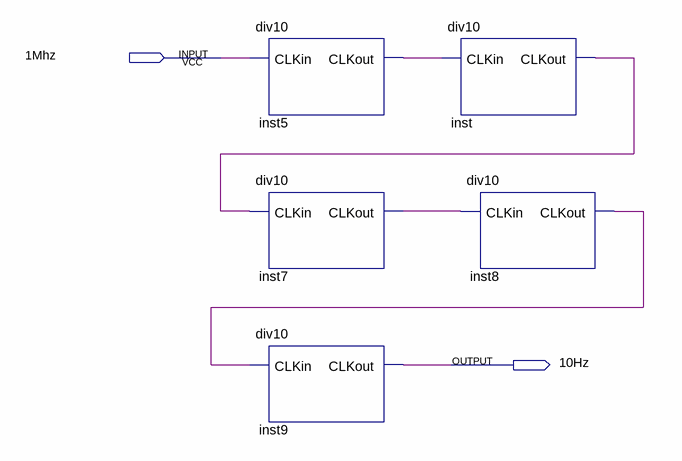
[diagram p0: schematic sheet]
// Quartus schematic gerador10Hz.bdf as structural Verilog: 5 symbols, 2 pins
module gerador10Hz (
  input  \1Mhz ,
  output \10Hz 
);

  wire inst5_clkout, inst7_clkout, inst8_clkout, inst_clkout;

  div10 inst5 (.CLKin(\1Mhz ), .CLKout(inst5_clkout));
  div10 inst7 (.CLKin(inst_clkout), .CLKout(inst7_clkout));
  div10 inst9 (.CLKin(inst8_clkout), .CLKout(\10Hz ));
  div10 inst (.CLKin(inst5_clkout), .CLKout(inst_clkout));
  div10 inst8 (.CLKin(inst7_clkout), .CLKout(inst8_clkout));
endmodule
